# Altium schematic sheet Display.SchDoc
size A4
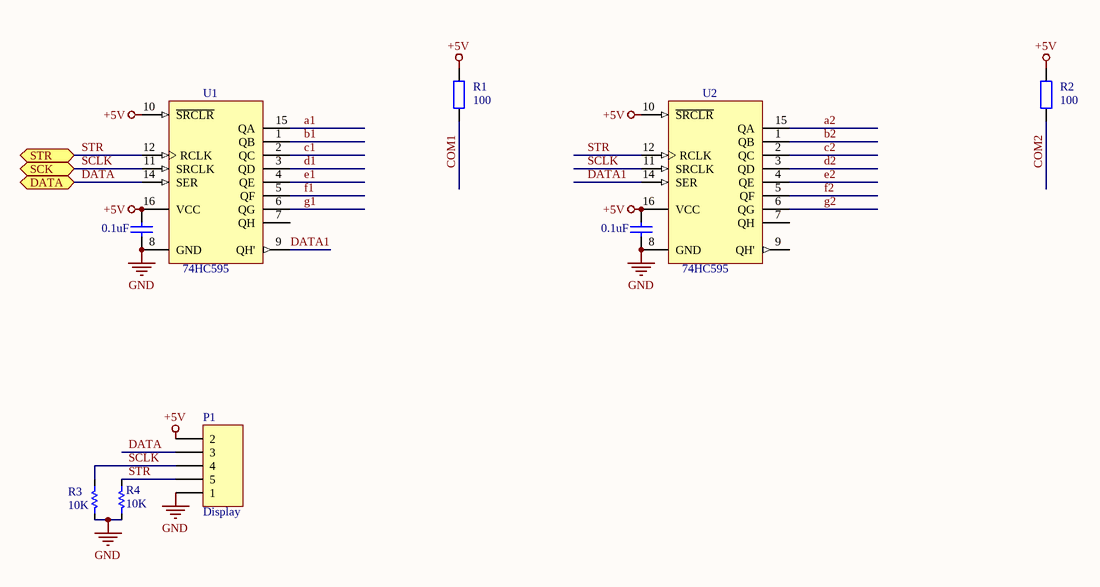
[diagram p0: Display.SchDoc]

## Parts
C1  0.1uF  [C0805]
C2  0.1uF  [C0805]
P1  Display  [CONN-5POS-PITCH2.54MM]
R1  100  [R1206]
R2  100  [R1206]
R3  10K  [R0805]
R4  10K  [R0805]
U1  74HC595  [16-SOIC]
U2  74HC595  [16-SOIC]

## Ports
DATA (bidir), SCK (bidir), STR (bidir)

## Nets
+5V: C1.1 C2.1 P1.2 R1.2 R2.2 U1.10(~{SRCLR}) U1.16(VCC) U2.10(~{SRCLR}) U2.16(VCC)
GND: C1.2 C2.2 P1.1 R3.2 R4.2 U1.8(GND) U1.13(~{OE}) U2.8(GND) U2.13(~{OE})
a1: U1.15(QA)
a2: U2.15(QA)
b1: U1.1(QB)
b2: U2.1(QB)
c1: U1.2(QC)
c2: U2.2(QC)
COM1: R1.1
COM2: R2.1
d1: U1.3(QD)
d2: U2.3(QD)
DATA: P1.3 U1.14(SER) ; port DATA
DATA1: U1.9(QH') U2.14(SER)
e1: U1.4(QE)
e2: U2.4(QE)
f1: U1.5(QF)
f2: U2.5(QF)
g1: U1.6(QG)
g2: U2.6(QG)
SCLK: P1.4 R3.1 U1.11(SRCLK) U2.11(SRCLK) ; port SCK
STR: P1.5 R4.1 U1.12(RCLK) U2.12(RCLK) ; port STR

Not connected (* = marked no-connect by the designer): U1 7(QH); U2 7(QH) 9(QH')

## Library data of the parts
C1 C2 = Cap: CAP CER 0.1UF 50V 10% X8R 0805; Manufacturer: TDK Corporation; Manufacturer Part Number: C2012X8R1H104K125AA; Link: http://www.digikey.com/product-detail/en/C2012X8R1H104K125AA/445-2514-1-ND/927171; Digi-Key Part Number: 445-2514-1-ND
P1 = Header 5: Header, 5-Pin
R1 R2 = Res2: RES 100 OHM 3W 5% AXIAL; Manufacturer Part Number: PNP300JR-73-100R; Manufacturer: Yageo; Link: http://www.digikey.com/product-detail/en/PNP300JR-73-100R/100AETR-ND/2058836; Digi-Key Part Number: 100AETR-ND
R3 R4 = Res1: RES 10K OHM 1/8W 1% 0805 SMD; Manufacturer Part Number: ERJ-6ENF1002V; Manufacturer: Panasonic Electronic Components; Digi-Key Part Number: P10.0KCCT-ND; Link: http://www.digikey.com/product-detail/en/ERJ-6ENF1002V/P10.0KCCT-ND/119248
U1 U2 = SN74HC595N: IC 8BIT SHIFT REG 3ST-OUT 16SOIC; Manufacturer: Texas Instruments; Manufacturer Part Number: SN74HC595DWR; Digi-Key Part Number: 296-14858-1-ND; Link: http://www.digikey.com/product-detail/en/SN74HC595DWR/296-14858-1-ND/562566